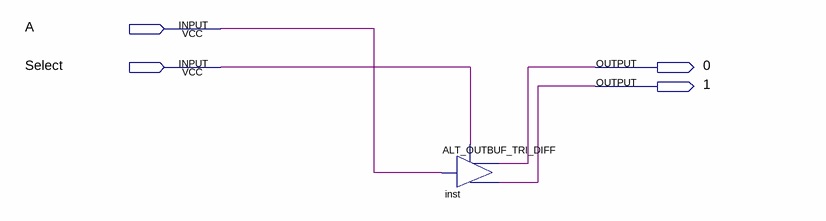
[diagram p0: schematic sheet]
// Quartus schematic 1x2 MUX.bdf as structural Verilog: 1 symbols, 4 pins
module \1x2_MUX  (
  input  A,
  input  Select,
  output \0 ,
  output \1 
);

  ALT_OUTBUF_TRI_DIFF inst (.i(A), .oe(Select), .obar(\1 ), .o(\0 ));
endmodule
